# EAGLE schematic Base Board (EAGLE 6.2)
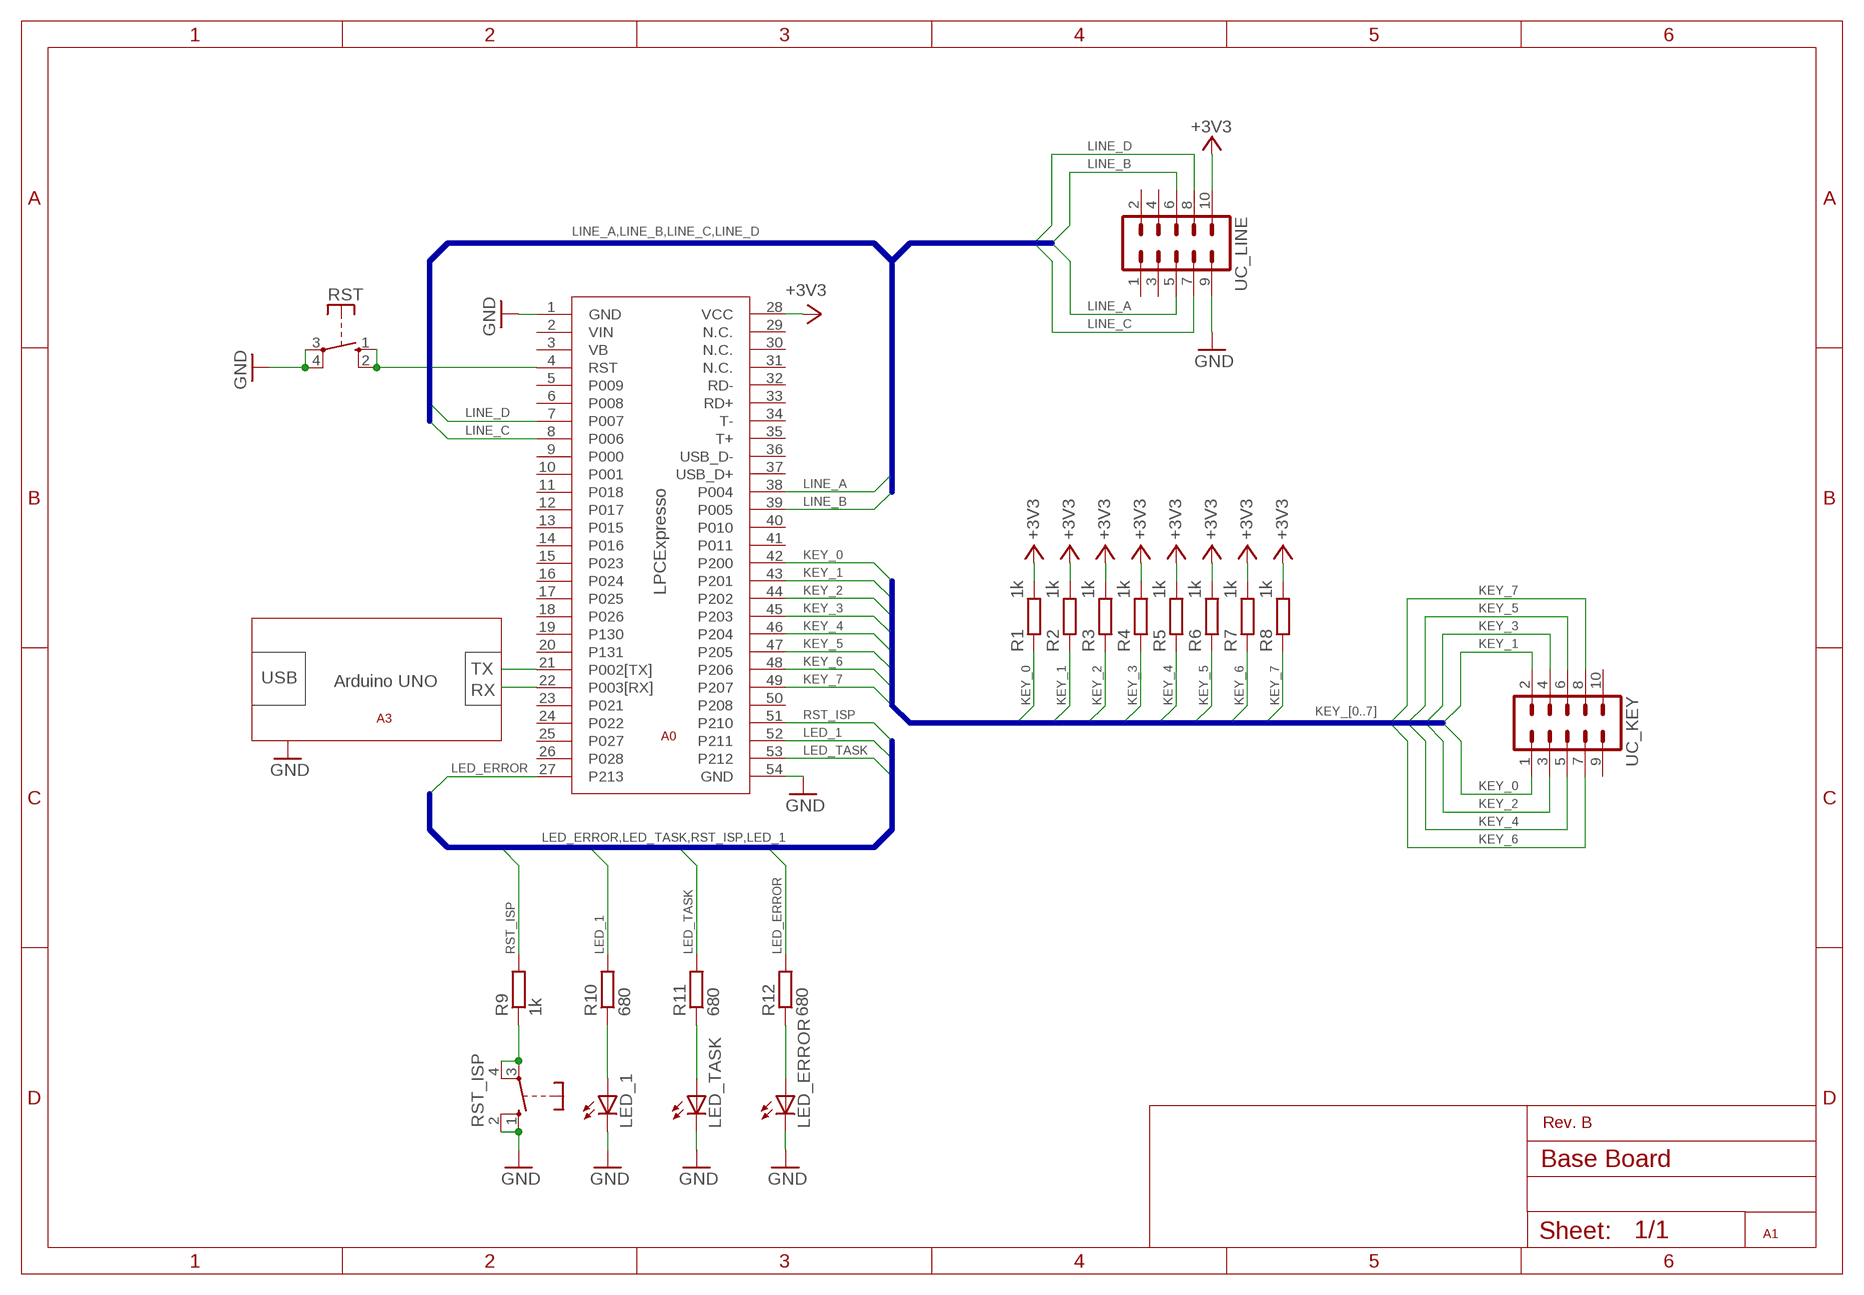
[diagram p0: schematic, sheet 1]

## Parts
LED_1  LED5MM  [LED5MM]
LED_ERROR  LED5MM  [LED5MM]
LED_TASK  LED5MM  [LED5MM]
R1  1k  R-EU_0204/5  [0204/5]
R2  1k  R-EU_0204/5  [0204/5]
R3  1k  R-EU_0204/5  [0204/5]
R4  1k  R-EU_0204/5  [0204/5]
R5  1k  R-EU_0204/5  [0204/5]
R6  1k  R-EU_0204/5  [0204/5]
R7  1k  R-EU_0204/5  [0204/5]
R8  1k  R-EU_0204/5  [0204/5]
R9  1k  R-EU_0204/5  [0204/5]
R10  680  R-EU_0204/5  [0204/5]
R11  680  R-EU_0204/5  [0204/5]
R12  680  R-EU_0204/5  [0204/5]
RST  DT6  [DT6]
RST_ISP  DT6  [DT6]
U$1  LPCEXPRESSO  [LPCEXPRESSO]
UC_KEY  ML10  [ML10]
UC_LINE  ML10  [ML10]

## Nets
+3V3: R1.1 R2.1 R3.1 R4.1 R5.1 R6.1 R7.1 R8.1 U$1.28(VCC) UC_LINE.10
GND: LED_1.K(C) LED_ERROR.K(C) LED_TASK.K(C) RST.3(P) RST.4(P) RST_ISP.1(S) RST_ISP.2(S) U$1.1(GND) U$1.54(GND) UC_LINE.9
KEY_0: R1.2 U$1.42(P200) UC_KEY.1
KEY_1: R2.2 U$1.43(P201) UC_KEY.2
KEY_2: R3.2 U$1.44(P202) UC_KEY.3
KEY_3: R4.2 U$1.45(P203) UC_KEY.4
KEY_4: R5.2 U$1.46(P204) UC_KEY.5
KEY_5: R6.2 U$1.47(P205) UC_KEY.6
KEY_6: R7.2 U$1.48(P206) UC_KEY.7
KEY_7: R8.2 U$1.49(P207) UC_KEY.8
LED_1: R10.2 U$1.52(P211)
LED_ERROR: R12.2 U$1.27(P213)
LED_TASK: R11.2 U$1.53(P212)
LINE_A: U$1.38(P004) UC_LINE.5
LINE_B: U$1.39(P005) UC_LINE.6
LINE_C: U$1.8(P006) UC_LINE.7
LINE_D: U$1.7(P007) UC_LINE.8
N$1: RST.1(S) RST.2(S) U$1.4(RST)
N$2: U$1.21(P002[TX])
N$3: U$1.22(P003[RX])
N$4: LED_ERROR.A R12.1
N$5: LED_TASK.A R11.1
N$7: LED_1.A R10.1
N$8: R9.1 RST_ISP.3(P) RST_ISP.4(P)
RST_ISP: R9.2 U$1.51(P210)
Unconnected: U$1.2(VIN) U$1.5(P009) U$1.6(P008) U$1.9(P000) U$1.10(P001) U$1.11(P018) U$1.12(P017) U$1.13(P015) U$1.14(P016) U$1.15(P023) U$1.16(P024) U$1.17(P025) U$1.18(P026) U$1.19(P130) U$1.20(P131) U$1.23(P021) U$1.24(P022) U$1.25(P027) U$1.26(P028) U$1.29(N.C.) U$1.30(N.C.) U$1.31(N.C.) U$1.32(RD-) U$1.33(RD+) U$1.34(T-) U$1.35(T+) U$1.36(USB_D-) U$1.37(USB_D+) U$1.40(P010) U$1.41(P011) U$1.50(P208) UC_KEY.9 UC_KEY.10 UC_LINE.1 UC_LINE.2 UC_LINE.3 UC_LINE.4

## Buses
KEY_[0..7]
LINE_A,LINE_B,LINE_C,LINE_D
LED_ERROR,LED_TASK,RST_ISP,LED_1

## Notes on the sheet
- TX
- USB | Arduino UNO
- RX
- A3
- A0
- Rev. B
- A1

## Power pins joined to a net without a drawn wire
VB: U$1.3(VB)

## Library data of the parts
LED_1 LED_ERROR LED_TASK = led:LED: LED OSRAM: - CHIPLED LG R971, LG N971, LY N971, LG Q971, LY Q971, LO R971, LY R971 LH N974, LH R974 LS Q976, LO Q976, LY Q976 LO Q996 - Hyper CHIPLED LW Q18S LB Q993, LB Q99A, LB R99A - SideLED LS A670, LO A670, LY A670, LG A670, LP A670 LB A673, LV A673, LT A673, LW A673 LH A674 LY A675 LS A676, LA A676, LO A676, LY A676, LW A676 LS A679, LY A679, LG A679 - Hyper Micro SIDELED® LS Y876, LA Y876, LO Y876, LY Y876 LT Y87S - SmartLED LW L88C, LW L88S LB L89C, LB L89S, LG L890 LS L89K, LO L89K, LY L89K LS L896, LA L896, LO L896, LY L896 - TOPLED LS T670, LO T670, LY T670, LG T670, LP T670 LSG T670, LSP T670, LSY T670, LOP T670, LYG T670 LG T671, LOG T671, LSG T671 LB T673, LV T673, LT T673, LW T673 LH T674 LS T676, LA T676, LO T676, LY T676, LB T676, LH T676, LSB T676, LW T676 LB T67C, LV T67C, LT T67C, LS T67K, LO T67K, LY T67K, LW E67C LS E67B, LA E67B, LO E67B, LY E67B, LB E67C, LV E67C, LT E67C LW T67C LS T679, LY T679, LG T679 LS T770, LO T770, LY T770, LG T770, LP T770 LB T773, LV T773, LT T773, LW T773 LH T774 LS E675, LA E675, LY E675, LS T675 LS T776, LA T776, LO T776, LY T776, LB T776 LHGB T686 LT T68C, LB T68C - Hyper Mini TOPLED® LB M676 - Mini TOPLED Santana® LG M470 LS M47K, LO M47K, LY M47K Source: http://www.osram.convergy.de LUXEON: - LUMILED® LXK2-PW12-R00, LXK2-PW12-S00, LXK2-PW14-U00, LXK2-PW14-V00 LXK2-PM12-R00, LXK2-PM12-S00, LXK2-PM14-U00 LXK2-PE12-Q00, LXK2-PE12-R00, LXK2-PE12-S00, LXK2-PE14-T00, LXK2-PE14-U00 LXK2-PB12-K00, LXK2-PB12-L00, LXK2-PB12-M00, LXK2-PB14-N00, LXK2-PB14-P00, LXK2-PB14-Q00 LXK2-PR12-L00, LXK2-PR12-M00, LXK2-PR14-Q00, LXK2-PR14-R00 LXK2-PD12-Q00, LXK2-PD12-R00, LXK2-PD12-S00 LXK2-PH12-R00, LXK2-PH12-S00 LXK2-PL12-P00, LXK2-PL12-Q00, LXK2-PL12-R00 Source: www.luxeon.com KINGBRIGHT: KA-3528ASYC Source: www.kingbright.com
R1-R12 = rcl:R-EU_: RESISTOR, European symbol
RST RST_ISP = switch-misc:DT: ITT SWITCH
U$1 = NL-Library:LPCEXPRESSO
UC_KEY UC_LINE = con-harting-ml:ML10: HARTING; OC_FARNELL: unknown; OC_NEWARK: unknown